# Altium schematic sheet Top_TB.SchDoc
size 431 x 279 mm; Author: Pawel Bukowiec; Organization: ORGANIZATION; Address1: ADDRESS 1; Address2: ADDRESS 2; Address3: ADDRESS 3; Address4: ADDRESS 4; Revision: 1; SheetNumber: 1; SheetTotal: 5; ENG_APP_DATE: --/--/--; DSN_APP_DATE: --/--/--; CHK_APP_DATE: --/--/--
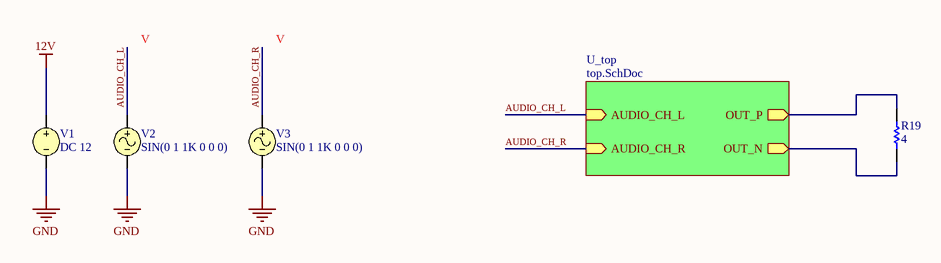
[diagram p0: Top_TB.SchDoc]

## Parts
R19  value 4  (hidden comment: Resistor)
V1  DC 12
V2  SIN(0 1 1K 0 0 0)
V3  SIN(0 1 1K 0 0 0)

## Sub-sheets
U_top = top.SchDoc: AUDIO_CH_L (in), AUDIO_CH_R (in), OUT_P (out), OUT_N (out)

## Nets
12V: V1.1
GND: V1.2 V2.2 V3.2
AUDIO_CH_L: V2.1 ; sheet U_top/AUDIO_CH_L
AUDIO_CH_R: V3.1 ; sheet U_top/AUDIO_CH_R
NetR19_1: R19.1 ; sheet U_top/OUT_N
NetR19_2: R19.2 ; sheet U_top/OUT_P

## Notes on the sheet
- Project Name:
- Company Confidential / Not for distribution!
- Document Name:
- Designer Name:
- Date/Time:
- Revision:

## Library data of the parts
R19 = Resistor: TC1: 0; SimulationGenericComponent: True; TC2: 0
V1 = VSRC: Voltage Source; Note: PCB Footprint - Not required; AC Magnitude: 0; Value: 12; Published: 8-Jun-2000; LatestRevisionDate: 17-Jul-2002; LatestRevisionNote: Re-released for DXP Platform.; PackageReference: Not Applicable; Publisher: Altium Limited; AC Phase: 0
V2 V3 = VSIN: Sinusoidal Voltage Source; Note: PCB Footprint - Not required; Offset: 0; Amplitude: 1; Published: 8-Jun-2000; LatestRevisionDate: 15-Nov-2004; LatestRevisionNote: Corrected Netlist.; PackageReference: Not Applicable; Publisher: Altium Limited; Frequency: 1K; Delay: 0; Damping Factor: 0; Phase: 0; DC Magnitude: 0; AC Magnitude: 1; AC Phase: 0